# EAGLE schematic Mixmaker_schematic (EAGLE 8.2.2)
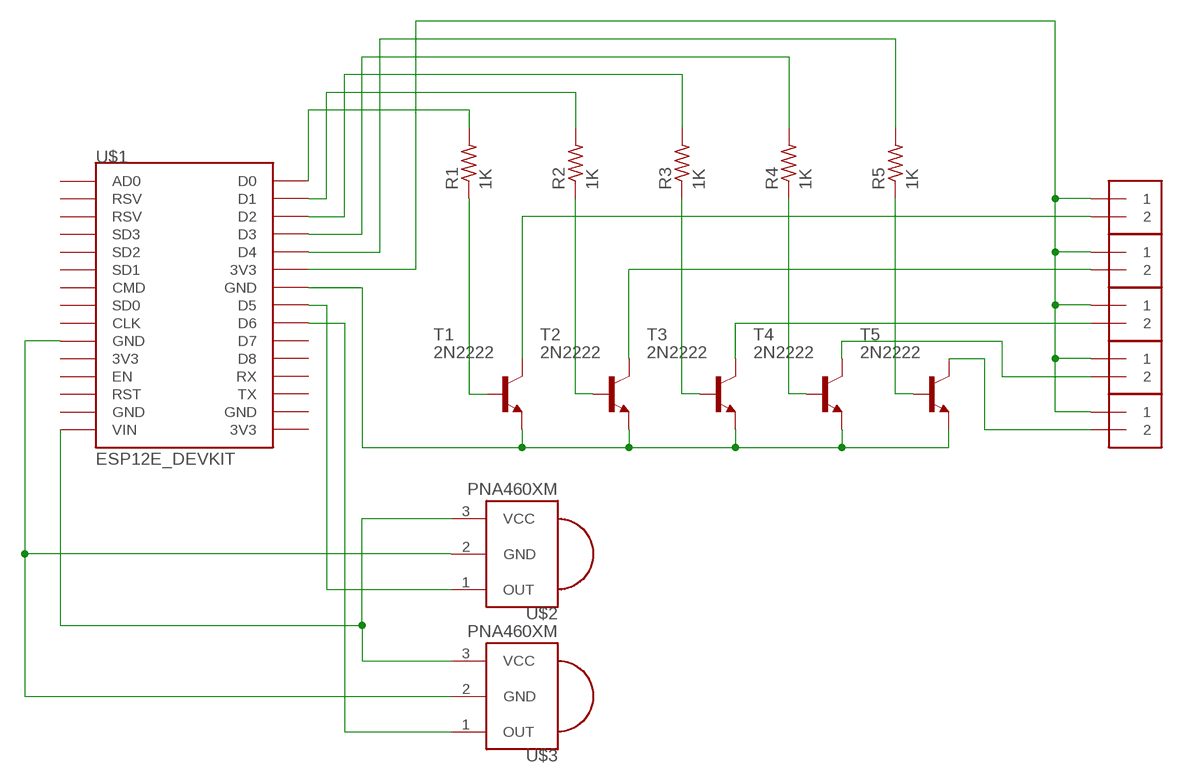
[diagram p0: schematic, sheet 1]

## Parts
J1  1X2-3.5MM  [1X2-3.5MM]
J2  1X2-3.5MM  [1X2-3.5MM]
J3  1X2-3.5MM  [1X2-3.5MM]
J4  1X2-3.5MM  [1X2-3.5MM]
J5  1X2-3.5MM  [1X2-3.5MM]
R1  1K  R-US_0204/7  [0204/7]
R2  1K  R-US_0204/7  [0204/7]
R3  1K  R-US_0204/7  [0204/7]
R4  1K  R-US_0204/7  [0204/7]
R5  1K  R-US_0204/7  [0204/7]
T1  2N2222  [TO92-EBC-OVAL]
T2  2N2222  [TO92-EBC-OVAL]
T3  2N2222  [TO92-EBC-OVAL]
T4  2N2222  [TO92-EBC-OVAL]
T5  2N2222  [TO92-EBC-OVAL]
U$1  ESP12E_DEVKIT  [ESP12E_DEVKIT]
U$2  PNA460XM  [PNA460XM]
U$3  PNA460XM  [PNA460XM]

## Nets
N$1: U$1.VIN U$2.3(VCC) U$3.3(VCC)
N$2: U$1.GND@0(GND) U$2.2(GND) U$3.2(GND)
N$3: R1.2 U$1.D0
N$4: R2.2 U$1.D1
N$5: R3.2 U$1.D2
N$6: R4.2 U$1.D3
N$7: R5.2 U$1.D4
N$8: U$1.D5 U$2.1(OUT)
N$9: U$1.D6 U$3.1(OUT)
N$10: J5.2 T5.C
N$11: R1.1 T1.B
N$12: R2.1 T2.B
N$13: R3.1 T3.B
N$14: R4.1 T4.B
N$15: R5.1 T5.B
N$16: T1.E T2.E T3.E T4.E T5.E U$1.GND@2(GND)
N$17: J4.2 T4.C
N$18: J3.2 T3.C
N$19: J2.2 T2.C
N$20: J1.2 T1.C
N$21: J1.1 J2.1 J3.1 J4.1 J5.1 U$1.3V3@1(3V3)
Unconnected: U$1.3V3@0(3V3) U$1.3V3@2(3V3) U$1.AD0 U$1.CLK U$1.CMD U$1.D7 U$1.D8 U$1.EN U$1.GND@1(GND) U$1.GND@3(GND) U$1.RST U$1.RSV@0(RSV) U$1.RSV@1(RSV) U$1.RX U$1.SD0 U$1.SD1 U$1.SD2 U$1.SD3 U$1.TX

## Library data of the parts
J1-J5 = adafruit:1X2: 3.5mm Terminal block http://www.ladyada.net/library/pcb/eaglelibrary.html
R1-R5 = adafruit:R-US_: RESISTOR, American symbol
T1-T5 = adafruit:2N2222: NPN TRANSISTOR Big oval pads
U$1 = ESP12E_DEVKIT:ESP12E_DEVKIT: ESP12E DEVKIT BOARD
U$2 U$3 = adafruit:PNA460XM: IR 38KHz receiver PNA4602 and related receivers http://www.ladyada.net/library/pcb/eaglelibrary.html